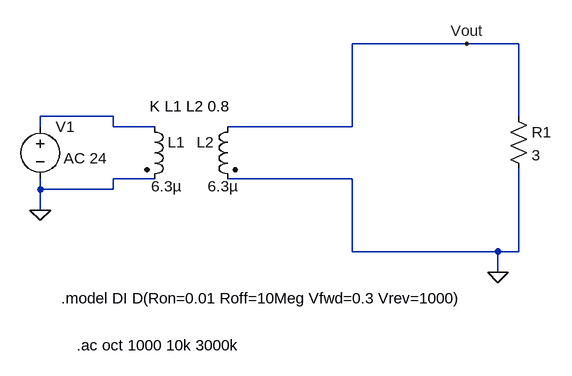
[diagram p0: schematic AC Analysis.asc]
AC Analysis.asc, the LTspice schematic file:
Version 4
SHEET 1 1232 744
WIRE 1056 96 880 96
WIRE 1136 96 1056 96
WIRE 512 208 400 208
WIRE 1136 208 1136 96
WIRE 400 224 400 208
WIRE 512 224 512 208
WIRE 576 224 512 224
WIRE 880 224 880 96
WIRE 880 224 688 224
WIRE 576 304 512 304
WIRE 880 304 688 304
WIRE 400 320 400 304
WIRE 512 320 512 304
WIRE 512 320 400 320
WIRE 400 352 400 320
WIRE 880 416 880 304
WIRE 1104 416 880 416
WIRE 1136 416 1136 288
WIRE 1136 416 1104 416
WIRE 1104 448 1104 416
FLAG 1056 96 Vout
FLAG 1104 448 0
FLAG 400 352 0
SYMBOL voltage 400 208 R0
WINDOW 123 36 64 Left 2
WINDOW 39 0 0 Left 0
SYMATTR Value2 AC 24
SYMATTR InstName V1
SYMATTR Value ""
SYMBOL ind2 560 208 R0
WINDOW 3 11 107 Left 2
SYMATTR Value 6.3µ
SYMATTR InstName L1
SYMATTR Type ind
SYMATTR SpiceLine Rser=19m
SYMBOL ind2 704 208 M0
WINDOW 3 -1 107 Left 2
SYMATTR Value 6.3µ
SYMATTR InstName L2
SYMATTR Type ind
SYMATTR SpiceLine Rser=19m
SYMBOL res 1120 192 R0
SYMATTR InstName R1
SYMATTR Value 3
TEXT 568 192 Left 2 !K L1 L2 0.8
TEXT 432 488 Left 2 !.model DI D(Ron=0.01 Roff=10Meg Vfwd=0.3 Vrev=1000)
TEXT 456 560 Left 2 !.ac oct 1000 10k 3000k

The netlist it stands for:
* AC Analysis.asc
V1 N001 0 AC 24
L1 N001 0 6.3µ Rser=19m
L2 Vout 0 6.3µ Rser=19m
R1 Vout 0 3
K L1 L2 0.8
.model DI D(Ron=0.01 Roff=10Meg Vfwd=0.3 Vrev=1000)
.ac oct 1000 10k 3000k
.backanno
.end